# EAGLE design VauDUOv1_0 (EAGLE 6.4)
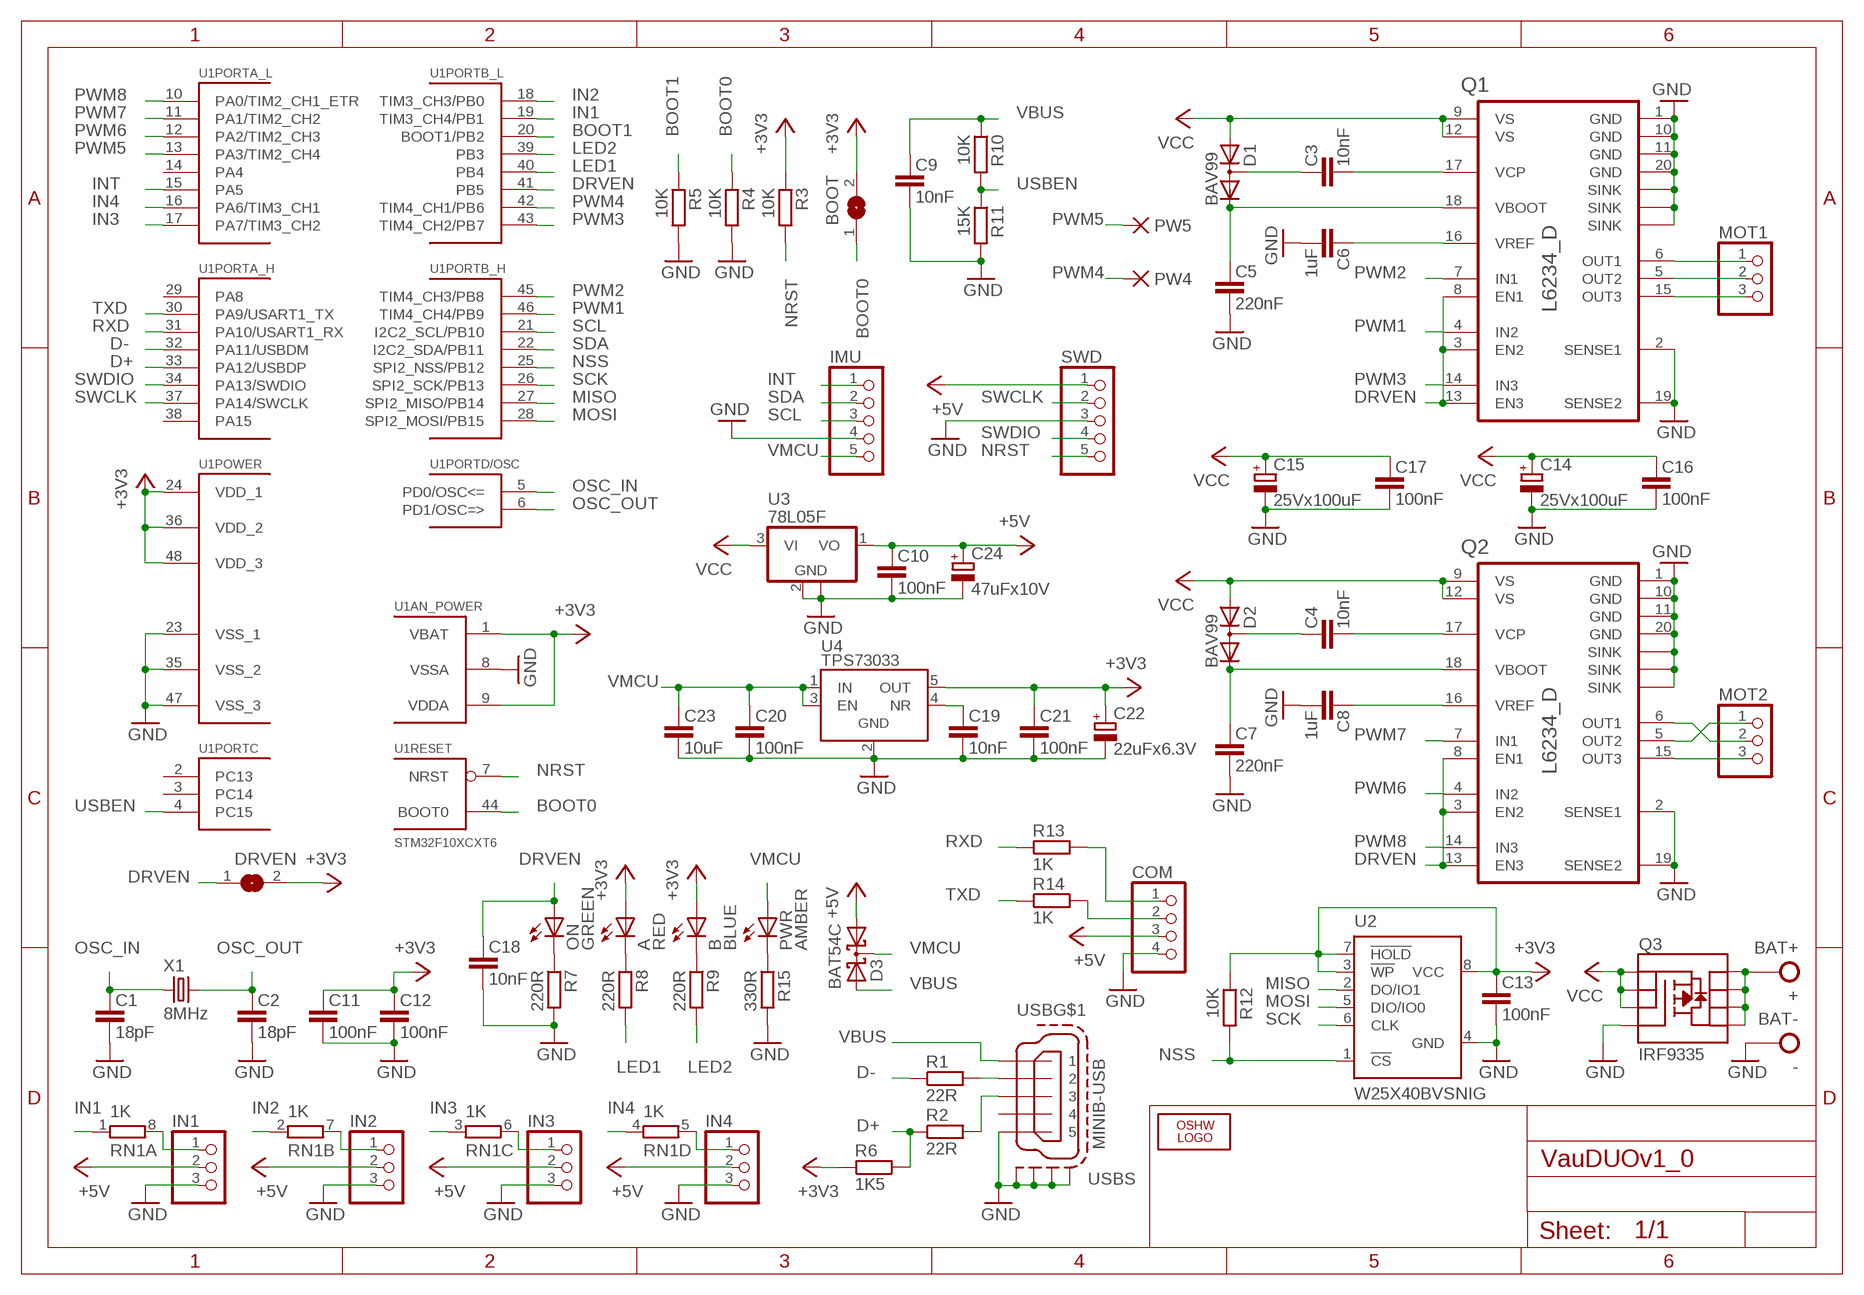
[diagram p0: schematic, sheet 1]

## Parts
+  BAT+  POWER-PAD-20S  [PAD20S]
-  BAT-  POWER-PAD-20R  [PAD20R]
A  RED  LEDCHIPLED_0805  [CHIPLED_0805]
B  BLUE  LEDCHIPLED_0805  [CHIPLED_0805]
BOOT  SJ  [SJ]
C1  18pF  C_EU_C0603G  [C0603G]
C2  18pF  C_EU_C0603G  [C0603G]
C3  10nF  C_EU_C0603  [C0603]
C4  10nF  C_EU_C0603  [C0603]
C5  220nF  C_EU_C0603G  [C0603G]
C6  1uF  C_EU_C0603G  [C0603G]
C7  220nF  C_EU_C0603G  [C0603G]
C8  1uF  C_EU_C0603G  [C0603G]
C9  10nF  C_EU_C0603G  [C0603G]
C10  100nF  C_EU_C0603G  [C0603G]
C11  100nF  C_EU_C0603G  [C0603G]
C12  100nF  C_EU_C0603G  [C0603G]
C13  100nF  C_EU_C0603G  [C0603G]
C14  25Vx100uF  CPOL-EUE2.5-7  [E2,5-7]
C15  25Vx100uF  CPOL-EUE2.5-7  [E2,5-7]
C16  100nF  C_EU_C0603G  [C0603G]
C17  100nF  C_EU_C0603G  [C0603G]
C18  10nF  C_EU_C0603G  [C0603G]
C19  10nF  C_EU_C0603G  [C0603G]
C20  100nF  C_EU_C0603G  [C0603G]
C21  100nF  C_EU_C0603G  [C0603G]
C22  22uFx6.3V  CPOL-EUSMCA  [SMC_A]
C23  10uF  C_EU_C0805  [C0805]
C24  47uFx10V  CPOL-EUSMCB  [SMC_B]
COM  PINHD-1X4  [1X04]
D1  BAV99  BAV199  [SOT23]
D2  BAV99  BAV199  [SOT23]
D3  BAT54C  [SOT23]
DRVEN  SJ  [SJ]
IMU  PINHD-1X5  [1X05]
IN1  PINHD-1X3  [1X03]
IN2  PINHD-1X3  [1X03]
IN3  PINHD-1X3  [1X03]
IN4  PINHD-1X3  [1X03]
LOGO1  OSHW_LOGO_10MILX0350-NT  [OSHW_10X350_NOTEXT]
MOT1  PINHD-1X3MOT  [1X03M]
MOT2  PINHD-1X3MOT  [1X03M]
ON  GREEN  LEDCHIPLED_0805  [CHIPLED_0805]
PW4  PAD-SMD09R  [SMD09R]
PW5  PAD-SMD09R  [SMD09R]
PWR  AMBER  LEDCHIPLED_0805  [CHIPLED_0805]
Q1  L6234_D  [POWERSO20]
Q2  L6234_D  [POWERSO20]
Q3  IRF9335  MOSFET-PCHANNEL-SOIC8  [SOIC-8]
R1  22R  R_EU_R0603  [R0603]
R2  22R  R_EU_R0603  [R0603]
R3  10K  R_EU_R0603  [R0603]
R4  10K  R_EU_R0603G  [R0603G]
R5  10K  R_EU_R0603G  [R0603G]
R6  1K5  R_EU_R0603  [R0603]
R7  220R  R_EU_R0603G  [R0603G]
R8  220R  R_EU_R0603  [R0603]
R9  220R  R_EU_R0603  [R0603]
R10  10K  R_EU_R0603  [R0603]
R11  15K  R_EU_R0603G  [R0603G]
R12  10K  R_EU_R0603  [R0603]
R13  1K  R_EU_R0603  [R0603]
R14  1K  R_EU_R0603  [R0603]
R15  330R  R_EU_R0603  [R0603]
RN1  1K  4R-NCAY16  [CAY16]
SWD  PINHD-1X5  [1X05]
U1  STM32F10XCXT6  [LQFP48]
U2  W25X40BVSNIG  [SOIC-8]
U3  78L05F  [SOT89]
U4  TPS73033  TPS769XX  [SOT23-5]
USB  MINIB-USB  MINI-USB-SCHIELD-32005-201  [32005-201]
X1  8MHz  CRYSTALHC49S  [HC49/S]

## Nets
+3V3: A.A B.A BOOT.2 C11.1 C12.1 C13.1 C21.1 C22.+ DRVEN.2 R3.1 R6.1 R12.1 U1.1(AN_POWER:VBAT) U1.9(AN_POWER:VDDA) U1.24(POWER:VDD_1) U1.36(POWER:VDD_2) U1.48(POWER:VDD_3) U2.3(!WP) U2.7(!HOLD) U2.8(VCC) U4.5(OUT)
+5V: C10.1 C24.+ COM.3 D3.1(A1) IN1.2 IN2.2 IN3.2 IN4.2 SWD.1 U3.1(VO)
BOOT0: BOOT.1 R4.1 U1.44(RESET:BOOT0)
BOOT1: R5.1 U1.20(PORTB_L:BOOT1/PB2)
D+: R2.1 R6.2 U1.33(PORTA_H:PA12/USBDP)
D-: R1.1 U1.32(PORTA_H:PA11/USBDM)
DRVEN: C18.1 DRVEN.1 ON.A Q1.3(EN2) Q1.8(EN1) Q1.13(EN3) Q2.3(EN2) Q2.8(EN1) Q2.13(EN3) U1.41(PORTB_L:PB5)
GND: -.P$1 C1.2 C2.2 C5.2 C6.2 C7.2 C8.2 C9.2 C10.2 C11.2 C12.2 C13.2 C14.- C15.- C16.2 C17.2 C18.2 C19.2 C20.2 C21.2 C22.- C23.2 C24.- COM.4 IMU.4 IN1.3 IN2.3 IN3.3 IN4.3 Q1.1(GND) Q1.2(SENSE1) Q1.10(GND) Q1.11(GND) Q1.19(SENSE2) Q1.20(GND) Q1.SINK1(SINK) Q1.SINK2(SINK) Q1.SINK3(SINK) Q2.1(GND) Q2.2(SENSE1) Q2.10(GND) Q2.11(GND) Q2.19(SENSE2) Q2.20(GND) Q2.SINK1(SINK) Q2.SINK2(SINK) Q2.SINK3(SINK) Q3.4(G) R4.2 R5.2 R7.2 R11.2 R15.2 SWD.3 U1.8(AN_POWER:VSSA) U1.23(POWER:VSS_1) U1.35(POWER:VSS_2) U1.47(POWER:VSS_3) U2.4(GND) U3.2(GND) U3.2@1(GND) U4.2(GND) USB.5 USB.M1(S:S1) USB.M2(S:S2) USB.M3(S:S3) USB.M4(S:S4)
IN1: RN1.1 U1.19(PORTB_L:TIM3_CH4/PB1)
IN2: RN1.2 U1.18(PORTB_L:TIM3_CH3/PB0)
IN3: RN1.3 U1.17(PORTA_L:PA7/TIM3_CH2)
IN4: RN1.4 U1.16(PORTA_L:PA6/TIM3_CH1)
INT: IMU.1 U1.15(PORTA_L:PA5)
LED1: R8.2 U1.40(PORTB_L:PB4)
LED2: R9.2 U1.39(PORTB_L:PB3)
MISO: U1.27(PORTB_H:SPI2_MISO/PB14) U2.2(DO/IO1)
MOSI: U1.28(PORTB_H:SPI2_MOSI/PB15) U2.5(DIO/IO0)
N$1: R1.2 USB.2
N$2: R2.2 USB.3
N$3: IN1.1 RN1.8
N$4: IN2.1 RN1.7
N$5: IN3.1 RN1.6
N$6: IN4.1 RN1.5
N$7 [VBAT]: MOT2.1 Q2.5(OUT2)
N$8 [VBAT]: MOT2.2 Q2.6(OUT1)
N$9: C4.2 Q2.17(VCP)
N$10: C3.2 Q1.17(VCP)
N$11 [VBAT]: MOT1.1 Q1.6(OUT1)
N$12 [VBAT]: MOT1.2 Q1.5(OUT2)
N$13 [VBAT]: MOT1.3 Q1.15(OUT3)
N$14: C6.1 Q1.16(VREF)
N$15: C8.1 Q2.16(VREF)
N$16 [VBAT]: MOT2.3 Q2.15(OUT3)
N$17: C3.1 D1.3(AC)
N$18: C4.1 D2.3(AC)
N$19: C7.1 D2.2(C) Q2.18(VBOOT)
N$20: C5.1 D1.2(C) Q1.18(VBOOT)
N$21: ON.C R7.1
N$22: A.C R8.1
N$23: B.C R9.1
N$24: C19.1 U4.4(NR)
N$25: COM.1 R13.2
N$26: COM.2 R14.2
N$27: PWR.C R15.1
NRST: R3.2 SWD.5 U1.7(RESET:NRST)
NSS: R12.2 U1.25(PORTB_H:SPI2_NSS/PB12) U2.1(!CS)
OSC_IN: C1.1 U1.5(PORTD/OSC:PD0/OSC<=) X1.1
OSC_OUT: C2.1 U1.6(PORTD/OSC:PD1/OSC=>) X1.2
PWM1: Q1.4(IN2) U1.46(PORTB_H:TIM4_CH4/PB9)
PWM2: Q1.7(IN1) U1.45(PORTB_H:TIM4_CH3/PB8)
PWM3: Q1.14(IN3) U1.43(PORTB_L:TIM4_CH2/PB7)
PWM4: PW4.PAD(P) U1.42(PORTB_L:TIM4_CH1/PB6)
PWM5: PW5.PAD(P) U1.13(PORTA_L:PA3/TIM2_CH4)
PWM6: Q2.4(IN2) U1.12(PORTA_L:PA2/TIM2_CH3)
PWM7: Q2.7(IN1) U1.11(PORTA_L:PA1/TIM2_CH2)
PWM8: Q2.14(IN3) U1.10(PORTA_L:PA0/TIM2_CH1_ETR)
RXD: R13.1 U1.31(PORTA_H:PA10/USART1_RX)
SCK: U1.26(PORTB_H:SPI2_SCK/PB13) U2.6(CLK)
SCL: IMU.3 U1.21(PORTB_H:I2C2_SCL/PB10)
SDA: IMU.2 U1.22(PORTB_H:I2C2_SDA/PB11)
SWCLK: SWD.2 U1.37(PORTA_H:PA14/SWCLK)
SWDIO: SWD.4 U1.34(PORTA_H:PA13/SWDIO)
TXD: R14.1 U1.30(PORTA_H:PA9/USART1_TX)
USBEN: R10.2 R11.1 U1.4(PORTC:PC15)
VBAT [VBAT]: +.P$1 Q3.5(D) Q3.6(D) Q3.7(D) Q3.8(D)
VBUS: C9.1 D3.2(A2) R10.1 USB.1
VCC [VBAT]: C14.+ C15.+ C16.1 C17.1 D1.1(A) D2.1(A) Q1.9(VS) Q1.12(VS) Q2.9(VS) Q2.12(VS) Q3.1(S) Q3.2(S) Q3.3(S) U3.3(VI)
VMCU: C20.1 C23.1 D3.3(CC) IMU.5 PWR.A U4.1(IN) U4.3(EN)
Unconnected: U1.2(PORTC:PC13) U1.3(PORTC:PC14) U1.14(PORTA_L:PA4) U1.29(PORTA_H:PA8) U1.38(PORTA_H:PA15) USB.4

## Library data of the parts
+ - = svBGC:POWER-PAD
A B ON PWR = svBGC:LED
BOOT DRVEN = svBGC:SJ: SMD solder JUMPER
C1-C13 C16-C21 C23 = svBGC:C_EU_
C14 C15 C22 C24 = svBGC:CPOL-EU: POLARIZED CAPACITOR, European symbol
COM = svBGC:PINHD-1X4: PIN HEADER
D1 D2 = svBGC:BAV199: DIODE low-leakage double diode
D3 = svBGC:BAT54C: Schottky Diodes Source: Fairchild .. BAT54.pdf
IMU SWD = svBGC:PINHD-1X5: PIN HEADER
IN1-IN4 MOT1 MOT2 = svBGC:PINHD-1X3: PIN HEADER
LOGO1 = ohw-logo:OSHW_LOGO_10MIL
PW4 PW5 = dpads:PAD: WIRE PAD Standard US Drill Sizes and SMD pads
Q1 Q2 = svBGC:L6234_
Q3 = svBGC:MOSFET-PCHANNEL
R1-R15 = svBGC:R_EU_
RN1 = svBGC:4R-N: Array Chip Resistor Source: RS Component / Phycomp; OC_FARNELL: unknown; OC_NEWARK: unknown
U1 = svBGC:STM32F10XCXT6: ST STM32F101/103 48pin LQFP
U2 = svBGC:W25X: Winbond SPI Flash Memory
U3 = linear:78L*: POSITOIV-VOLTAGE REGULATORS Output up to 100 mA Source: http://focus.ti.com/lit/ds/symlink/ua78l05.pdf
U4 = svBGC:TPS769XX: Texas Instruments LDO Regulator
USB = svBGC:MINI-USB-SCHIELD-: MINI USB-B Conector Source: www.cypressindustries.com; OC_FARNELL: unknown; OC_NEWARK: unknown
X1 = svBGC:CRYSTAL: CRYSTAL; OC_FARNELL: 1667008; OC_NEWARK: unknown

## Net classes
1 VBAT: width 0.254 mm, drill 0.305 mm, clearance 0.254 mm

## Board
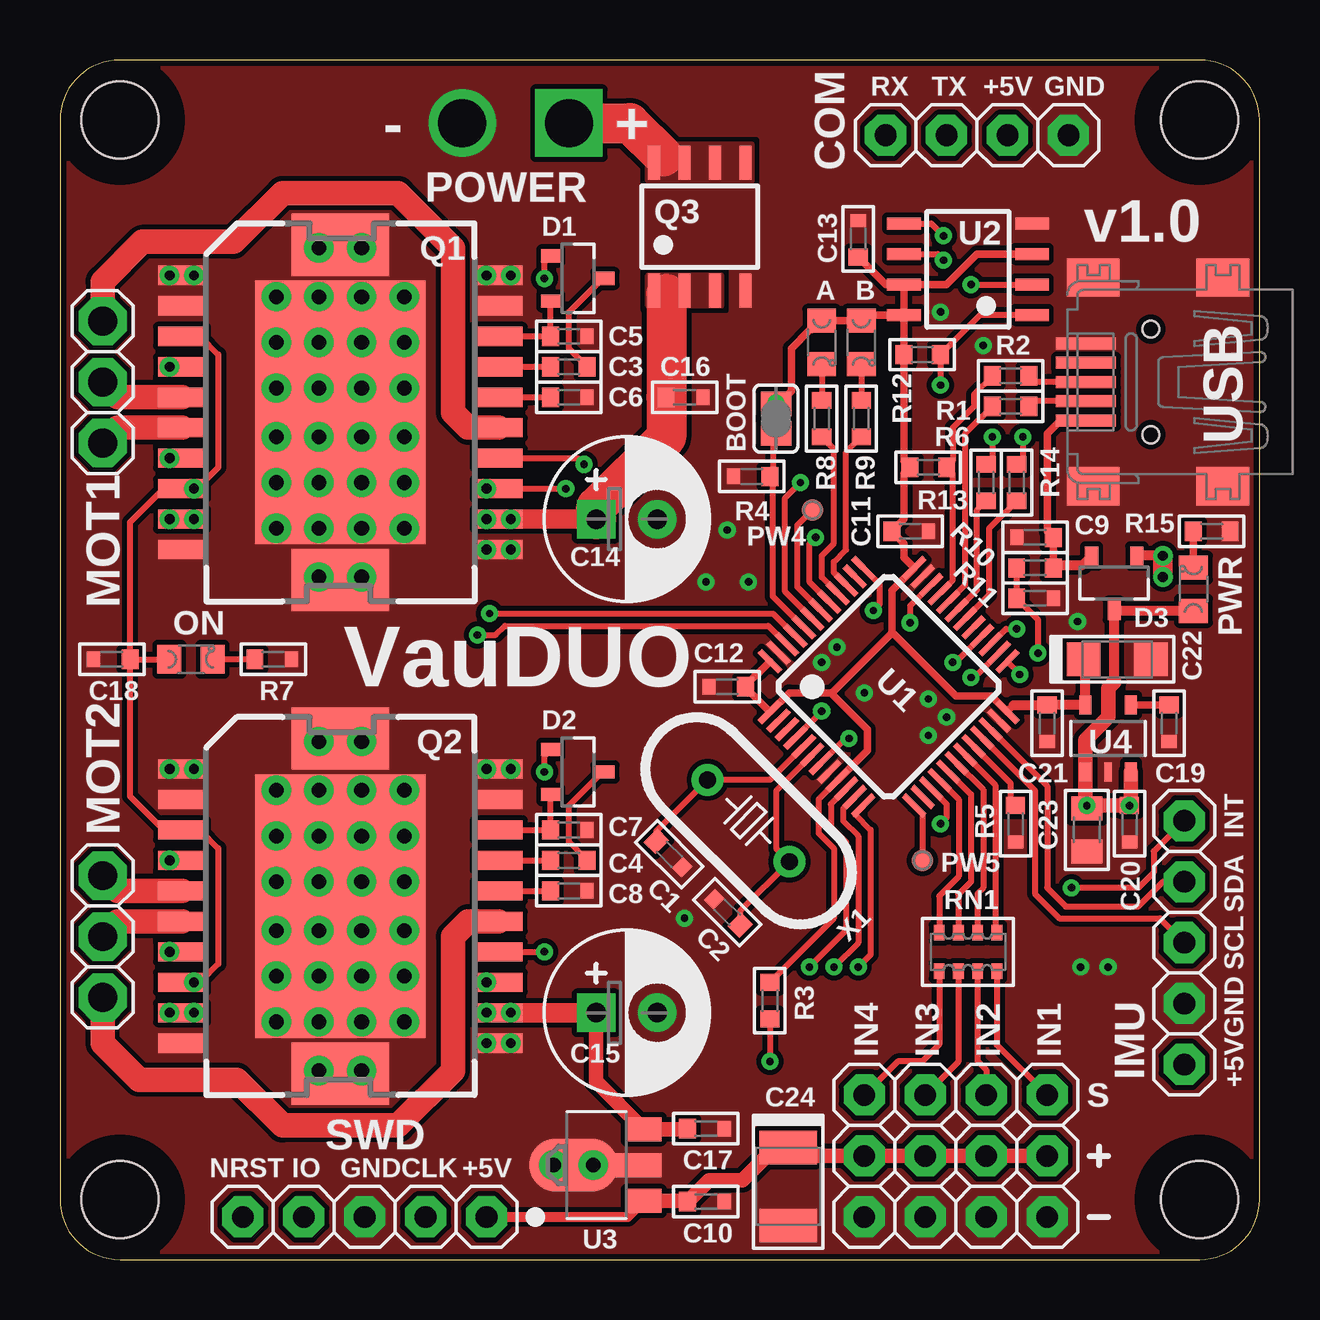
[diagram p1: board, top side]
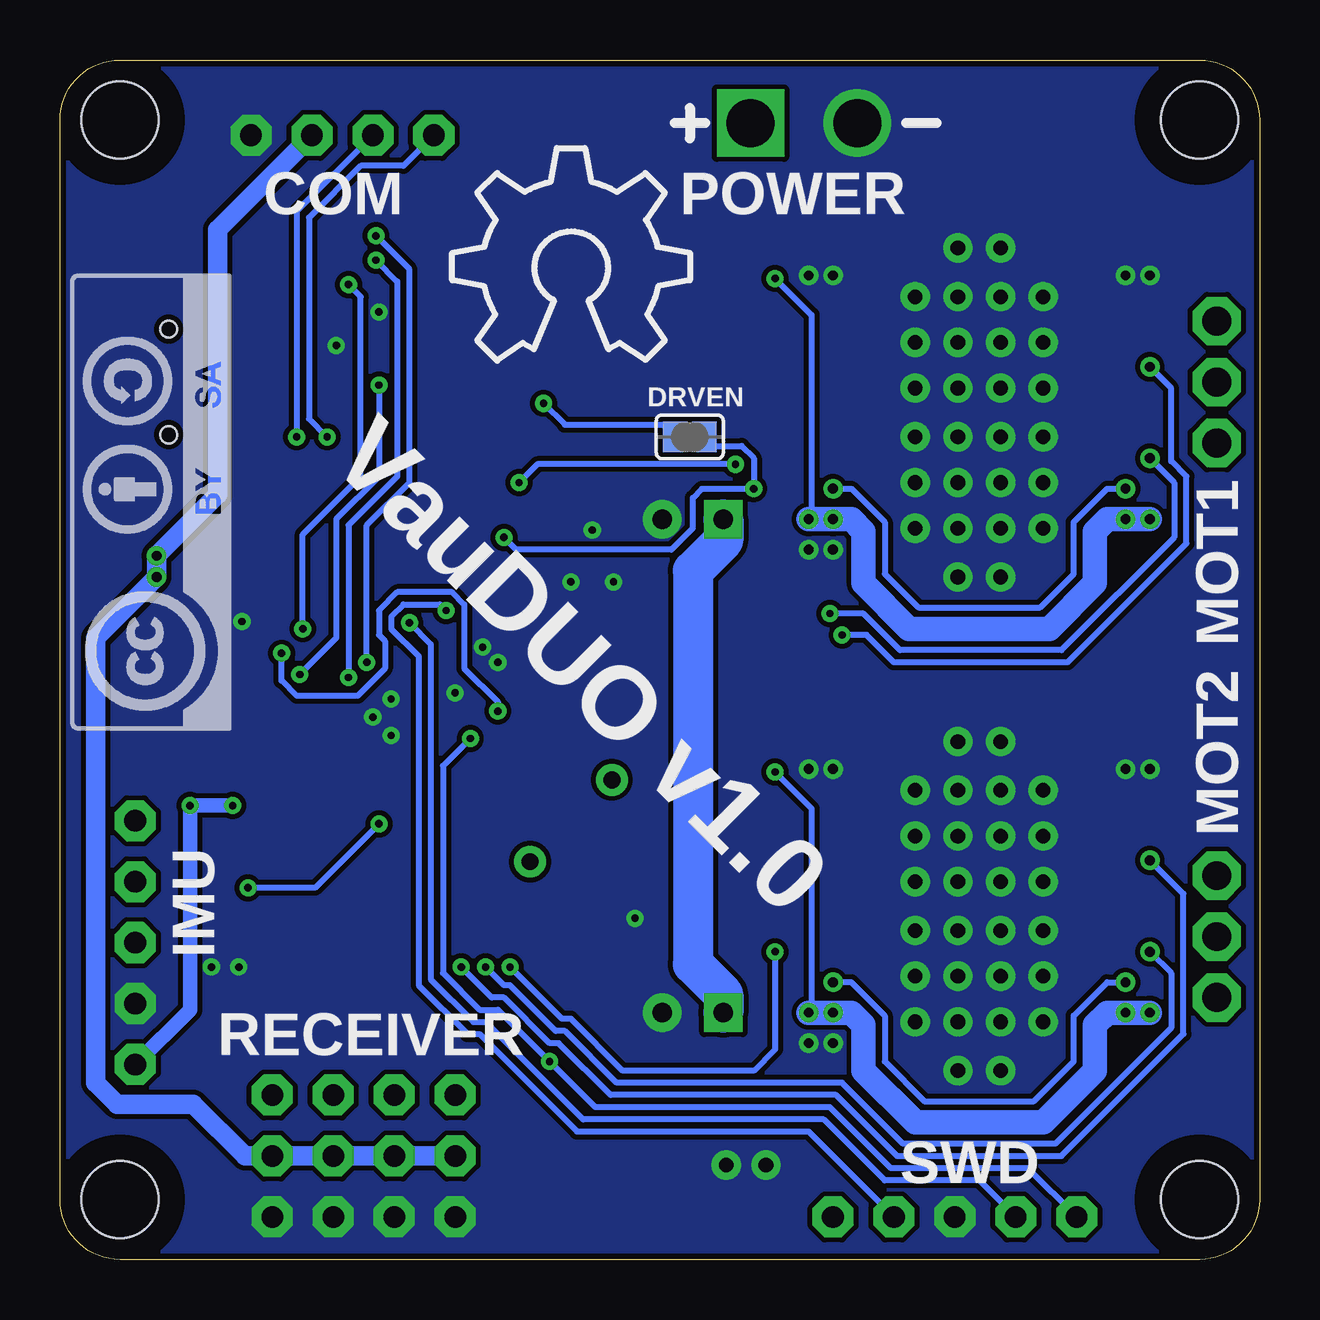
[diagram p2: board, bottom side, seen from below]

Size 50 x 50 mm. Coordinates in mm from the lower left corner, seen from the top.
Outline: 2.5,0 47.5,0 arc90 50,2.5 50,47.5 arc90 47.5,50 2.5,50 arc90 0,47.5 0,2.5 arc90 2.5,0
Copper layers (1*16): Top 0.035mm / dielectric 1.5mm / Bottom 0.035mm
Design rules "default *": minimum track width 8mil, minimum drill 12mil, track to track 8mil, track to pad 8mil, pad to pad 8mil, via to via 8mil, smd to smd 0mil, copper to edge 10mil, drill to drill 12mil, minimum pad ring 10mil, minimum via ring 8mil, stop-mask expansion 4mil, vias tented up to drill 16mil, thermal gap 10mil
Holes 3.2 mm at 2.5,47.5 47.5,47.5 47.5,2.5 2.5,2.5
tRestrict: area 0,0 to 5,5; area 45,0 to 50,5; area 45,45 to 50,50; area 0,45 to 5,50
bRestrict: area 45,45 to 50,50; area 0,45 to 5,50; area 0,0 to 5,5; area 45,0 to 50,5

### Footprints (pad centres in the part's own frame; a part is rotated, then mirrored left to right if it is on the bottom)
PAD20S = drill 2 square: P$1 0,0
PAD20R = drill 2: P$1 0,0
CHIPLED_0805 = smd 1.2 x 1: A 0,-0.9; C 0,0.9
SJ = smd 1.016 x 1.27: 1 -0.61,0; 2 0.61,0
C0603G = smd 0.7 x 0.8: 1 -0.762,0 | smd 0.548 x 0.648: 2 0.762,0
C0603 = smd 0.7 x 0.8: 1 -0.762,0; 2 0.762,0
E2,5-7 = drill 0.813 pad 1.6 square: + -1.27,0 | drill 0.813 pad 1.6: - 1.27,0
SMC_A = smd 1.4 x 1.4: + -1.4,0; - 1.4,0
C0805 = smd 1 x 1.3: 1 -0.889,0; 2 0.889,0
SMC_B = smd 1.4 x 2.4: + -1.627,0; - 1.627,0
1X04 = drill 0.9 octagon: 1 -3.81,0; 2 -1.27,0; 3 1.27,0; 4 3.81,0
SOT23 = smd 0.55 x 0.8: 1 -0.94,-1.13; 2 0.94,-1.13; 3 0,1.13
1X05 = drill 0.9 octagon: 1 -5.08,0; 2 -2.54,0; 3 0,0; 4 2.54,0; 5 5.08,0
1X03 = drill 0.9 octagon: 1 -2.54,0; 2 0,0; 3 2.54,0
1X03M = drill 1.2 octagon: 1 -2.54,0; 2 0,0; 3 2.54,0
SMD09R = smd 0.9 x 0.9: PAD 0,0
POWERSO20 = smd 0.8 x 2: 1 -5.715,-6.6; 2 -4.445,-6.6; 3 -3.175,-6.6; 4 -1.905,-6.6; 5 -0.635,-6.6; 6 0.635,-6.6; 7 1.905,-6.6; 8 3.175,-6.6; 9 4.445,-6.6; 10 5.715,-6.6; 11 5.715,6.6; 12 4.445,6.6; 13 3.175,6.6; 14 1.905,6.6; 15 0.635,6.6; 16 -0.635,6.6; 17 -1.905,6.6; 18 -3.175,6.6; 19 -4.445,6.6; 20 -5.715,6.6 | smd 10.973 x 7.112: SINK1 0,0 | smd 2.591 x 4.064: SINK2 -6.985,0; SINK3 6.985,0
SOIC-8 = smd 0.5 x 1.4: 1 -1.905,-2.667; 2 -0.635,-2.667; 3 0.635,-2.667; 4 1.905,-2.667; 5 1.905,2.667; 6 0.635,2.667; 7 -0.635,2.667; 8 -1.905,2.667
R0603 = smd 0.7 x 0.8: 1 -0.762,0; 2 0.762,0
R0603G = smd 0.7 x 0.8: 1 -0.762,0 | smd 0.548 x 0.648: 2 0.762,0
CAY16 = smd 0.45 x 0.65: 1 -1.2,-0.8; 2 -0.4,-0.8; 3 0.4,-0.8; 4 1.2,-0.8; 5 1.2,0.8; 6 0.4,0.8; 7 -0.4,0.8; 8 -1.2,0.8
LQFP48 = smd 0.25 x 1.2: 1 -2.75,-4.25; 2 -2.25,-4.25; 3 -1.75,-4.25; 4 -1.25,-4.25; 5 -0.75,-4.25; 6 -0.25,-4.25; 7 0.25,-4.25; 8 0.75,-4.25; 9 1.25,-4.25; 10 1.75,-4.25; 11 2.25,-4.25; 12 2.75,-4.25; 25 2.75,4.25; 26 2.25,4.25; 27 1.75,4.25; 28 1.25,4.25; 29 0.75,4.25; 30 0.25,4.25; 31 -0.25,4.25; 32 -0.75,4.25; 33 -1.25,4.25; 34 -1.75,4.25; 35 -2.25,4.25; 36 -2.75,4.25 | smd 1.2 x 0.25: 13 4.25,-2.75; 14 4.25,-2.25; 15 4.25,-1.75; 16 4.25,-1.25; 17 4.25,-0.75; 18 4.25,-0.25; 19 4.25,0.25; 20 4.25,0.75; 21 4.25,1.25; 22 4.25,1.75; 23 4.25,2.25; 24 4.25,2.75; 37 -4.25,2.75; 38 -4.25,2.25; 39 -4.25,1.75; 40 -4.25,1.25; 41 -4.25,0.75; 42 -4.25,0.25; 43 -4.25,-0.25; 44 -4.25,-0.75; 45 -4.25,-1.25; 46 -4.25,-1.75; 47 -4.25,-2.25; 48 -4.25,-2.75
SOT89 = smd 1 x 1.5: 1 -1.499,-1.981; 3 1.499,-1.981 | smd 1 x 2: 2 0,-1.727 | smd 2.2 x 3.7: 2@1 0,0.94
SOT23-5 = smd 0.5 x 0.8: 1 -0.95,-1.397; 3 0.95,-1.397; 4 0.95,1.397; 5 -0.95,1.397 | smd 0.297 x 0.8: 2 0,-1.397
32005-201 = smd 2.5 x 0.5: 1 2.7,1.6; 2 2.7,0.8; 3 2.7,0; 4 2.7,-0.8; 5 2.7,-1.6 | smd 2.2 x 1.6: M1 -3,-4.35; M2 -3,4.35; M3 2.4,4.35; M4 2.4,-4.35 | hole 0.7: 0,2.2; 0,-2.2
HC49/S = drill 0.7: 1 -2.413,0; 2 2.413,0

### Placement (x,y rotation side)
+  21.21,47.37 0 top
-  16.76,47.37 0 top
A  31.75,38.23 180 top
B  33.4,38.23 180 top
BOOT  29.84,35.05 90 top
C1  25.4,16.89 315 top
C2  27.81,14.48 135 top
C3  21.21,37.21 180 top
C4  21.21,16.64 180 top
C5  21.21,38.48 0 top
C6  21.21,35.94 0 top
C7  21.21,17.91 0 top
C8  21.21,15.37 0 top
C9  40.64,30.1 180 top
C10  26.92,2.41 0 top
C11  35.43,30.35 0 top
C12  27.81,23.88 180 top
C13  33.27,42.55 90 top
C14  23.62,30.86 0 top
C15  23.62,10.29 0 top
C16  26.04,35.94 0 top
C17  26.92,5.46 0 top
C18  2.16,25.02 180 top
C19  46.23,22.35 270 top
C20  44.58,18.16 270 top
C21  41.15,22.35 270 top
C22  44.07,25.02 0 top
C23  42.8,17.91 270 top
C24  30.35,3.05 270 top
COM  38.23,46.86 0 top
D1  21.59,40.89 270 top
D2  21.59,20.32 270 top
D3  43.94,28.19 180 top
DRVEN  23.75,34.29 180 bottom
IMU  46.86,13.21 270 top
IN1  41.15,4.32 270 top
IN2  38.61,4.32 270 top
IN3  36.07,4.32 270 top
IN4  33.53,4.32 270 top
LOGO1  33.66,37.47 0 bottom
MOT1  1.78,36.58 90 top
MOT2  1.78,13.46 270 top
ON  5.46,25.02 270 top
PW4  31.37,31.24 0 top
PW5  35.94,16.64 0 top
PWR  47.24,27.94 0 top
Q1  11.68,35.31 270 top
Q2  11.68,14.73 270 top
Q3  26.67,43.05 0 top
R1  39.62,35.56 0 top
R2  39.62,36.83 0 top
R3  29.59,10.79 270 top
R4  28.83,32.64 180 top
R5  39.83,18.16 270 top
R6  36.2,33.02 0 top
R7  8.89,25.02 0 top
R8  31.75,35.05 270 top
R9  33.4,35.05 270 top
R10  40.64,28.83 180 top
R11  40.64,27.56 0 top
R12  35.94,37.72 0 top
R13  38.61,32.38 90 top
R14  39.88,32.38 90 top
R15  48.01,30.35 0 top
RN1  37.85,12.83 180 top
SWD  12.7,1.78 180 top
U1  34.54,23.88 315 top
U2  37.85,41.27 90 top
U3  22.35,3.94 90 top
U4  43.69,21.72 0 top
USB  45.47,36.58 180 top
X1  28.7,18.29 315 top

### Tracks (layer width: path | path; a pad name or v marks a point on that pad's centre or on a via)
+3V3  (via drill 0.3)
  Top 0.254: 28.57,23.92 C12.1 28.57,23.84 | R3.1 32.26,14.22 32.26,17.14 31.62,17.78 31.62,19.19 U1.9 | 31.24,38.73 31.36,38.73 A.A | U1.24 39.49,22.86 | 33.64,39.37 B.A
  Top 0.305: B.A A.A | U1.48 28.57,23.92 | 28.57,23.84 U1.1 30.4,23.62 32.13,23.62 32.16,23.6 | 32.16,23.6 33.66,22.1 33.66,21.22 U1.9 | 32.16,23.6 34.7,26.14 | U2.8 R12.1 35.18,33.27 R6.1 35.18,32.77 35.18,30.86 C11.1 35.18,29.84 35.18,29.25 U1.36 34.67,27.89 34.67,26.16 34.7,26.14 | U2.8 U2.7 | U2.3 38.23,41.91 36.96,40.64 U2.7 | U1.24 38.81,23.5 37.34,23.5 34.7,26.14 | U2.7 34.42,40.64 C13.1 | 31.24,38.73 30.48,37.97 30.48,36.2 29.97,35.69 v29.84,35.69 BOOT.2 | 39.49,22.86 39.75,23.11 | U2.8 33.64,39.37
  Top 0.406: C22.+ 42.74,24.95 U4.5 C21.1 39.75,23.11
  Bottom 0.254: v29.84,35.69 28.96,34.8 24.87,34.8 DRVEN.2
+5V  (via drill 0.41)
  Top 0.406: SWD.1 23.67,1.78 U3.1 | IN4.2 | v45.97,29.34 44.9,29.34 D3.1
  Top 0.61: U3.1 26.14,2.44 C10.1 27.05,3.3 28.45,3.3 29.46,4.32 30,4.32 C24.+ 30.71,4.32 IN4.2 | 33.66,4.32 IN3.2 IN2.2 IN1.2
  Top 0.813: v45.97,29.34 v45.97,28.45
  Bottom 0.813: IN4.2 IN3.2 IN2.2 IN1.2 42.29,4.32 44.45,6.48 47.62,6.48 48.51,7.37 48.51,25.91 v45.97,28.45 v45.97,29.34 43.43,31.88 43.43,42.93 COM.3
BOOT0
  Top 0.254: U1.44 29.72,27.64 29.72,32.51 R4.1 29.72,32.77 29.72,34.31 BOOT.1
BOOT1
  Top 0.254: U1.20 39.62,19.86 39.62,19.13 R5.1
D+
  Top 0.254: R2.1 38.1,36.07 38.1,35.56 37.21,34.67 37.21,33.27 R6.2 37.21,32.77 37.21,28.31 U1.33
D-
  Top 0.254: U1.32 37.72,28.11 37.72,34.42 R1.1
DRVEN  (via drill 0.3, 0.41)
  Top 0.254: v5.59,11.56 Q2.8 5.84,11.56 6.6,12.32 6.6,17.14 5.84,17.91 Q2.3 4.32,17.91 2.92,19.3 C18.1 | v17.78,11.56 Q2.13 | Q1.3 5.84,38.48 6.6,37.72 6.6,33.02 5.71,32.13 v5.59,32.13 Q1.8 4.32,32.13 2.92,30.73 C18.1 | v17.78,32.13 Q1.13 v21.08,32.13 | C18.1 ON.A | U1.41 31.24,28.24 31.24,29.84 v31.5,30.1
  Bottom 0.254: v5.59,11.56 6.35,11.56 7.75,10.16 7.75,8.26 9.4,6.6 13.97,6.6 15.62,8.26 15.62,10.16 17.02,11.56 v17.78,11.56 | v17.78,32.13 17.02,32.13 15.62,30.73 15.62,28.57 14.22,27.18 9.14,27.18 7.75,28.57 7.75,30.73 6.35,32.13 v5.59,32.13 | DRVEN.1 23.11,34.29 22.73,33.91 21.59,33.91 21.08,33.4 v21.08,32.13 23.24,32.13 23.62,31.75 23.62,30.48 24.51,29.59 30.99,29.59 v31.5,30.1
GND  (via drill 0.3, 0.41, 0.61)
  other vias: 9.02,40.13 10.79,40.13 12.57,40.13 14.35,40.13 10.79,42.16 12.57,42.16 10.79,28.45 12.57,28.45 9.02,38.23 9.02,36.32 9.02,34.29 9.02,32.38 9.02,30.48 10.79,30.48 12.57,30.48 14.35,30.48 10.79,32.38 12.57,32.38 14.35,32.38 10.79,34.29 12.57,34.29 14.35,34.29 10.79,36.32 12.57,36.32 14.35,36.32 10.79,38.23 12.57,38.23 14.35,38.23 10.79,21.59 12.57,21.59 9.02,19.56 10.79,19.56 12.57,19.56 14.35,19.56 9.02,17.65 10.79,17.65 12.57,17.65 14.35,17.65 9.02,15.75 10.79,15.75 12.57,15.75 14.35,15.75 9.02,13.72 10.79,13.72 12.57,13.72 14.35,13.72 9.02,11.81 10.79,11.81 12.57,11.81 14.35,11.81 9.02,9.91 10.79,9.91 12.57,9.91 14.35,9.91 10.79,7.87 12.57,7.87 22.23,3.94 20.57,3.94 4.57,41.02 5.59,41.02 17.78,41.02 18.8,41.02 17.78,29.59 18.8,29.59 4.57,20.45 5.59,20.45 17.78,20.45 18.8,20.45 17.78,9.02 18.8,9.02 33.53,23.62 36.2,21.84 36.2,23.37 36.96,22.61 42.55,12.19 43.69,12.19 38.48,38.1 36.7,39.5 42.42,26.59 26.04,14.22 31.75,24.89 32.38,25.53 26.92,28.24 28.7,28.24 27.81,30.4
  pour Bottom (isolate 0.203, rank 6, no thermals): 0,0 0,50 50,50 50,0
  pour Top (isolate 0.203, rank 6, no thermals): 0,0 0,50 50,50 50,0
IN1
  Top 0.254: U1.19 38.99,19.79 38.99,13.68 RN1.1
IN2
  Top 0.254: U1.18 38.48,19.59 38.48,15.49 38.25,15.26 RN1.2
IN3
  Top 0.254: U1.17 37.97,19.39 37.97,15.75 37.45,15.22 RN1.3
IN4
  Top 0.254: U1.16 37.47,19.19 37.47,15.97 36.65,15.15 RN1.4
INT  (via drill 0.3)
  Top 0.254: U1.15 36.96,18.99 36.96,18.41 v36.7,18.16 | IMU.1 45.59,17.02 45.59,16.13 44.96,15.49 v42.16,15.49
  Bottom 0.254: v36.7,18.16 39.37,15.49 v42.16,15.49
LED1
  Top 0.254: U1.40 31.75,28.44 31.75,29.34 32.26,29.84 32.26,33.78 R8.2 31.62,34.16
LED2
  Top 0.254: U1.39 32.26,28.64 32.26,29.08 32.77,29.59 32.77,33.66 R9.2
MISO  (via drill 0.3)
  Top 0.254: U1.27 39.43,26.29 v39.88,26.29 | v37.97,40.64 U2.2
  Bottom 0.254: v39.88,26.29 39.88,30.23 37.47,32.64 37.47,40.13 v37.97,40.64
MOSI  (via drill 0.3)
  Top 0.254: U1.28 37.33,24.89 v37.21,24.89 | U2.5 36.32,43.18 v36.83,42.67
  Bottom 0.254: v37.21,24.89 37.21,30.61 35.43,32.38 35.43,41.27 v36.83,42.67
N$1
  Top 0.254: USB.2 40.6,35.78 R1.2
N$2
  Top 0.254: USB.3 40.64,36.58 R2.2
N$3
  Top 0.254: RN1.8 39.05,8.95 39.06,8.95 IN1.1
N$4
  Top 0.254: RN1.7 38.25,8.27 38.61,7.91 IN2.1
N$5
  Top 0.254: RN1.6 37.45,8.24 IN3.1
N$6
  Top 0.254: RN1.5 36.65,8.96 35.94,8.26 34.92,8.26 IN4.1
N$7
  Top 1.016: Q2.5 2.41,15.37 MOT2.1
N$8
  Top 1.016: Q2.6 2.41,14.1 MOT2.2
N$9
  Top 0.254: Q2.17 C4.2
N$10
  Top 0.254: Q1.17 C3.2
N$11
  Top 1.016: Q1.6 2.41,34.67 MOT1.1
N$12
  Top 1.016: Q1.5 2.41,35.94 MOT1.2
N$13
  Top 1.016: Q1.15 17.02,34.67 16.38,35.31 16.38,42.16 14.1,44.45 9.27,44.45 7.24,42.42 3.43,42.42 1.78,40.77 MOT1.3
N$14
  Top 0.254: Q1.16 C6.1
N$15
  Top 0.254: Q2.16 C8.1
N$16
  Top 1.016: Q2.15 17.02,14.1 16.38,13.46 16.38,7.87 14.1,5.59 9.27,5.59 7.37,7.49 3.3,7.49 1.78,9.02 MOT2.3
N$17
  Top 0.254: C3.1 21.21,37.97 21.21,39.5 22.61,40.89 D1.3
N$18
  Top 0.254: C4.1 21.21,17.4 21.21,18.92 22.61,20.32 D2.3
N$19
  Top 0.254: Q2.18 C7.1 20.45,19.37 D2.2
N$20
  Top 0.254: Q1.18 C5.1 20.45,39.94 D1.2
N$21
  Top 0.254: R7.1 ON.C
N$22
  Top 0.254: A.C R8.1
N$23
  Top 0.254: B.C R9.1
N$24
  Top 0.305: U4.4 C19.1
N$25  (via drill 0.3)
  Top 0.254: v38.86,34.29 38.86,33.4 R13.2
  Bottom 0.254: COM.1 35.69,45.59 37.47,45.59 39.62,43.43 39.62,35.05 v38.86,34.29
N$26  (via drill 0.3)
  Top 0.254: v40.13,34.29 40.13,33.4 R14.2
  Bottom 0.254: COM.2 40.13,43.69 v40.13,34.29
N$27
  Top 0.305: PWR.C R15.1
NRST  (via drill 0.3)
  Top 0.254: R3.2 v29.59,8.26 | U1.7 32.74,21.72 v32.89,21.72
  Bottom 0.254: SWD.5 9.65,3.81 15.37,3.81 17.91,6.35 27.69,6.35 v29.59,8.26 31.75,10.41 32.51,10.41 34.04,11.94 34.04,20.57 v32.89,21.72
NSS  (via drill 0.3)
  Top 0.254: U2.1 38.35,39.37 R12.2 v36.7,36.45 | v40.01,24.38 40.01,24.43 U1.25
  Bottom 0.254: v36.7,36.45 36.7,32.64 38.48,30.86 38.48,25.91 v40.01,24.38
OSC_IN
  Top 0.254: U1.5 29.6,19.99 X1.1 24.86,17.86 C1.1
OSC_OUT
  Top 0.254: U1.6 29.84,19.53 29.84,17.14 X1.2 28.35,14.53 C2.1
PWM1  (via drill 0.3, 0.41)
  Top 0.254: U1.46 29.53,26.42 18.54,26.42 18.16,26.04 v17.4,26.04 | Q1.4 v4.57,37.21
  Bottom 0.254: v4.57,37.21 3.68,36.32 3.68,33.27 3.05,32.64 3.05,29.84 8,24.89 15.24,24.89 16.38,26.04 v17.4,26.04
PWM2  (via drill 0.3, 0.41)
  Top 0.254: U1.45 29.73,26.92 v17.91,26.92 | Q1.7 v4.57,33.4
  Bottom 0.254: v4.57,33.4 3.56,32.38 3.56,30.1 8.26,25.4 14.99,25.4 16.51,26.92 v17.91,26.92
PWM3  (via drill 0.3)
  Top 0.254: U1.43 30.23,27.84 30.23,31.75 v30.86,32.38 | 18.16,33.4 Q1.14 21.59,33.4 v21.84,33.15
  Bottom 0.254: v21.84,33.15 30.1,33.15 v30.86,32.38
PWM4
  Top 0.254: U1.42 30.73,28.04 30.73,30.61 PW4.PAD
PWM5
  Top 0.254: U1.13 35.94,18.59 PW5.PAD
PWM6  (via drill 0.3, 0.41)
  Top 0.254: v4.57,16.64 Q2.4 | v33.27,12.19 33.78,12.7 33.78,17.91 33.15,18.54 33.15,18.59 U1.12
  Bottom 0.254: v4.57,16.64 3.17,15.24 3.17,9.4 8.26,4.32 15.11,4.32 17.65,6.86 27.05,6.86 29.21,9.02 29.59,9.02 31.5,10.92 32,10.92 v33.27,12.19
PWM7  (via drill 0.3, 0.41)
  Top 0.254: Q2.7 v4.57,12.83 | U1.11 32.64,18.79 32.64,18.29 33.27,17.65 33.27,13.21 v32.26,12.19
  Bottom 0.254: v4.57,12.83 3.68,11.94 3.68,9.65 8.51,4.83 14.86,4.83 17.4,7.37 26.8,7.37 28.96,9.53 29.34,9.53 31.24,11.43 31.5,11.43 v32.26,12.19
PWM8  (via drill 0.3)
  Top 0.254: Q2.14 v20.19,12.83 | U1.10 32.13,18.99 32.13,18.03 32.77,17.4 32.77,13.72 v31.24,12.19
  Bottom 0.254: v20.19,12.83 20.19,8.76 21.08,7.87 26.54,7.87 28.7,10.03 29.08,10.03 v31.24,12.19
RXD
  Top 0.254: R13.1 38.23,31.24 38.23,28.19 38.23,27.91 U1.31
SCK  (via drill 0.3)
  Top 0.254: U1.26 38.11,24.26 v37.97,24.26 | U2.6 36.58,41.91 v36.83,41.66
  Bottom 0.254: v36.83,41.66 35.94,40.77 35.94,32.64 37.97,30.61 v37.97,24.26
SCL
  Top 0.254: U1.21 40.64,19.55 40.64,15.24 41.66,14.22 45.85,14.22 IMU.3
SDA
  Top 0.254: U1.22 41.15,19.75 41.15,15.49 41.93,14.72 44.94,14.72 45.97,15.75 IMU.2
SWCLK  (via drill 0.3)
  Top 0.254: U1.37 34.16,28.15 34.16,27.3 v33.91,27.05
  Bottom 0.254: SWD.2 18.8,5.33 28.45,5.33 32.51,9.4 33.02,9.4 35.05,11.43 35.05,25.15 36.2,26.29 36.2,26.8 35.69,27.3 34.16,27.3 v33.91,27.05
SWDIO  (via drill 0.3)
  Top 0.254: U1.34 35.43,27.24 v35.43,26.54
  Bottom 0.254: v35.43,26.54 34.54,25.65 34.54,11.68 32.77,9.91 32.26,9.91 28.19,5.84 18.16,5.84 15.62,3.3 11.68,3.3 SWD.4
TXD
  Top 0.254: U1.30 38.73,27.71 38.73,30.48 R14.1
USBEN  (via drill 0.3)
  Top 0.254: R10.2 R11.1 40.77,26.67 v40.77,25.27 | U1.4 v31.75,22.85 v31.75,22.86
  Bottom 0.254: v40.77,25.27 40.77,24.13 40.13,23.5 37.59,23.5 36.45,24.64 36.45,25.78 36.7,26.04 36.7,27.05 35.94,27.81 33.66,27.81 33.15,27.3 33.15,24.64 31.75,23.24 v31.75,22.86
VBAT
  Top 1.676: +.P$1 23.75,47.37 25.15,45.97
  pour Top (isolate 0.254, no thermals): 24.51,46.48 28.83,46.48 28.83,44.96 24.51,44.96
VBUS
  Top 0.305: USB.1 41.71,34.98 41.15,34.42 41.15,30.35 C9.1 R10.1
  Top 0.406: R10.1 41.53,28.96 42.63,28.96 D3.2
VCC  (via drill 0.3, 0.41)
  Top 0.254: v20.19,20.32 20.19,20.99 D2.1 | v20.19,40.89 20.19,41.57 D1.1
  Top 0.61: C15.+ 22.35,7.42 U3.3 26.14,5.44 C17.1
  Top 0.813: C14.+ v18.8,30.86 Q1.12 | C15.+ v18.8,10.29 | v17.78,10.29 Q2.12 | v5.59,10.29 Q2.9 | 4.95,30.86 Q1.9 v5.59,30.86
  Top 1.676: C14.+ 22.35,31.37 25.27,34.29 C16.1 25.27,40.26
  Bottom 0.254: v20.19,20.32 18.67,18.8 18.67,10.41 v18.8,10.29 | v20.19,40.89 18.67,39.37 18.67,30.99 v18.8,30.86
  Bottom 1.016: v18.8,10.29 v17.78,10.29 17.02,10.29 16.51,9.78 16.51,7.87 14.35,5.71 9.02,5.71 6.86,7.87 6.86,9.78 6.35,10.29 v5.59,10.29 v4.57,10.29 | v4.57,30.86 v5.59,30.86 6.35,30.86 6.86,30.35 6.86,28.19 8.76,26.29 14.61,26.29 16.51,28.19 16.51,30.35 17.02,30.86 v17.78,30.86 v18.8,30.86
  Bottom 1.676: C14.+ 22.35,29.97 23.62,28.7 23.62,12.32 22.35,11.05 C15.+
  pour Top (isolate 0.254, no thermals): 24.51,41.02 27.56,41.02 27.56,39.75 24.51,39.75
VMCU  (via drill 0.3)
  Top 0.406: 43.94,24.07 D3.3 43.97,27.04 PWR.A
  Top 0.61: U4.3 44.64,18.98 C20.1 v42.8,18.92 | 43.94,24.07 43.69,23.82 43.69,22.61 42.74,21.66 U4.1 42.74,18.98 v42.8,18.92 | v42.8,18.92 C23.1
  Bottom 0.61: v42.8,18.92 C20.1 44.58,10.41 IMU.5
  other vias: 44.58,18.92

### Text on the board
tPlace: RX | TX | +5V | GND | POWER | v1.0 | VauDUO | INT | SDA | SCL | GND | +5V | S | NRST | IO | GND | CLK | +5V
bPlace: POWER | COM | MOT1 | VauDUO v1.0 | MOT2 | IMU | RECEIVER | SWD